# EAGLE schematic esquematico2 (EAGLE 9.6.1)
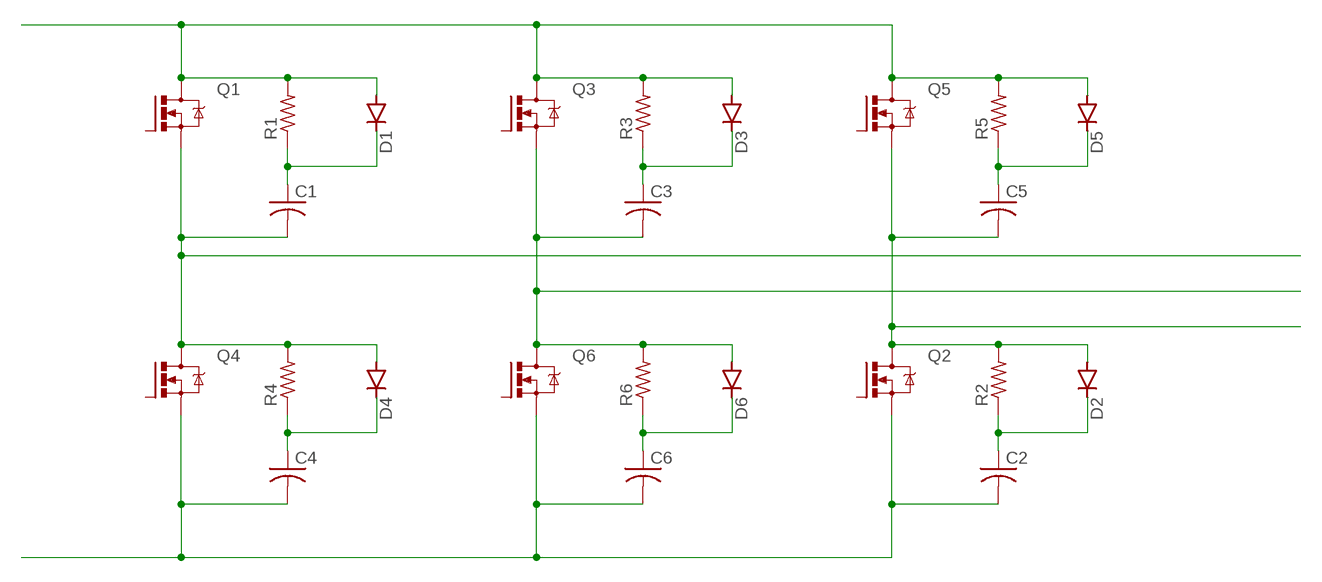
[diagram p0: schematic, sheet 1]

## Parts
C1  C-US025-024X044  [C025-024X044]
C2  C-US025-024X044  [C025-024X044]
C3  C-US025-024X044  [C025-024X044]
C4  C-US025-024X044  [C025-024X044]
C5  C-US025-024X044  [C025-024X044]
C6  C-US025-024X044  [C025-024X044]
D1  1N4004  [DO41-10]
D2  1N4004  [DO41-10]
D3  1N4004  [DO41-10]
D4  1N4004  [DO41-10]
D5  1N4004  [DO41-10]
D6  1N4004  [DO41-10]
Q1  IRF540  [TO220BV]
Q2  IRF540  [TO220BV]
Q3  IRF540  [TO220BV]
Q4  IRF540  [TO220BV]
Q5  IRF540  [TO220BV]
Q6  IRF540  [TO220BV]
R1  FLIPFLOP-RES  [0805-THM]
R2  FLIPFLOP-RES  [0805-THM]
R3  FLIPFLOP-RES  [0805-THM]
R4  FLIPFLOP-RES  [0805-THM]
R5  FLIPFLOP-RES  [0805-THM]
R6  FLIPFLOP-RES  [0805-THM]

## Nets
N$1: D1.A D3.A D5.A Q1.D Q3.D Q5.D R1.2 R3.2 R5.2
N$2: C1.1 D1.C R1.1
N$3: C1.2 D4.A Q1.S Q4.D R4.2
N$4: C5.2 D2.A Q2.D Q5.S R2.2
N$5: C2.1 D2.C R2.1
N$8: C3.1 D3.C R3.1
N$9: C3.2 D6.A Q3.S Q6.D R6.2
N$11: C4.1 D4.C R4.1
N$12: C2.2 C4.2 C6.2 Q2.S Q4.S Q6.S
N$14: C5.1 D5.C R5.1
N$17: C6.1 D6.C R6.1
Unconnected: Q1.G Q2.G Q3.G Q4.G Q5.G Q6.G

## Library data of the parts
C1-C6 = adafruit:C-US: CAPACITOR, American symbol
D1-D6 = diode:1N4004: DIODE general purpose rectifier, 1 A
Q1-Q6 = transistor-power:IRF540: HEXFET Power MOSFET
R1-R6 = adafruit:FLIPFLOP-RES: Flip Flop resistor An 0805 resistor inside a standard 1/4W 5% resistor. Makes for easy mods